# Altium schematic sheet [03]-CONNECTOR,SBC.SchDoc: S32K1_CONTROLLER (part 3 of 3)
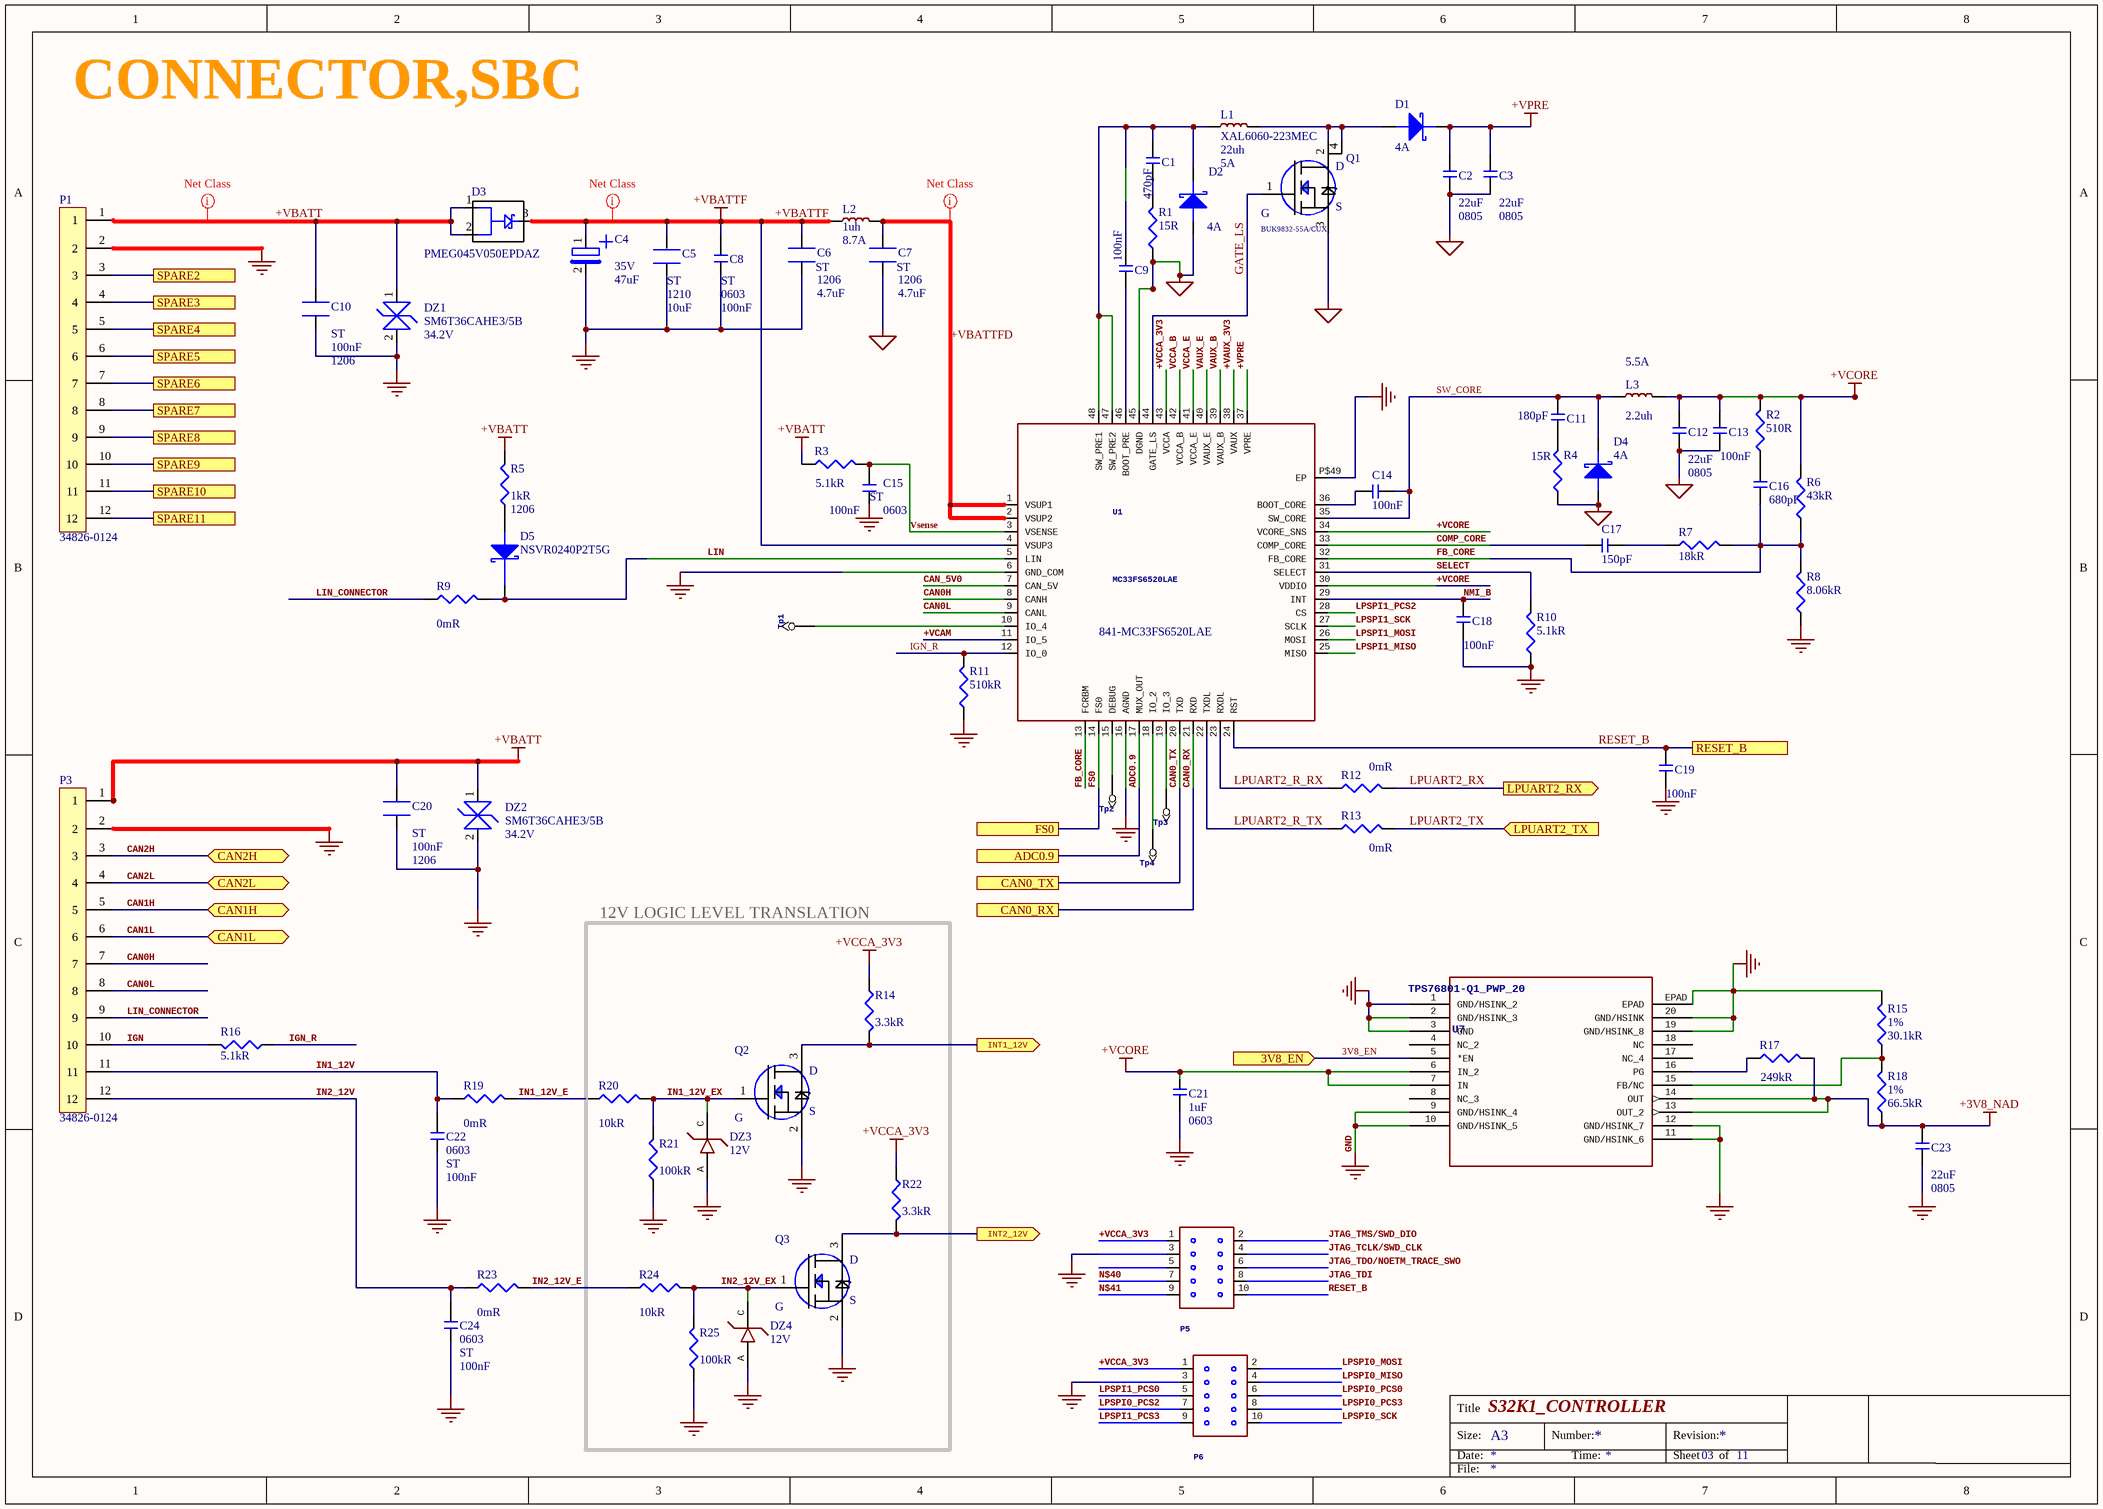
[diagram p2: [03]-CONNECTOR,SBC.SchDoc]

## Library data of the parts (continued)
R5 = ERJ-8GEYJ102V: Res Thick Film 1206 1K Ohm 5% 1/4W ±200ppm/°C Molded SMD Punched Carrier T/R; Manufacturer: Panasonic; Power Rating: 250mW; Voltage Rating: 200V; Supplier 1: Arrow; Manufacturer Part Number: ERJ-8GEYJ102V; Stock 1: 75000; Pricing 1: 5000 = 0.00490, 1 = 0.09480, 10 = 0.02000, 25 = 0.01800, 100 = 0.00860, 250 = 0.00770, 500 = 0.00690, 1000 = 0.00670, 3000 = 0.00600, 6000 = 0.00570, 15000 = 0.00550, 30000 = 0.00530 (USD); Mount: Surface Mount; Case Code (Metric): 3216; Case Code (Imperial): 1206; Contact Plating: Tin; Min Operating Temperature: -55°C; Max Operating Temperature: 155°C; Tolerance: 5%; Packaging: Tape and Reel; Package Quantity: 1; Composition: Thick Film; Number of Terminations: 2; Termination: SMD/SMT; Temperature Coefficient: 200ppm/°C; Military Standard: Not; Max Power Dissipation: 250mW; Voltage Rating (DC): 200V; Features: Automotive AEC-Q200; Length: 3.2mm; Height: 0.6mm; Width: 0.063inch; Depth: 1.6mm; Radiation Hardening: No; REACH SVHC: Unknown; Lead Free: Lead Free; ComponentLink1URL: http://www.mouser.com/ds/2/315/AOA0000CE1-37422.pdf?src-supplier=Mouser; ComponentLink1Description: http://www.mouser.com/ds/2/315/AOA0000CE1-37422.pdf?src-supplier=Mouser; ComponentLink2URL: http://www.farnell.com/datasheets/2059623.pdf?src-supplier=Farnell; ComponentLink2Description: http://www.farnell.com/datasheets/2059623.pdf?src-supplier=Farnell; ComponentLink3URL: http://industrial.panasonic.com/www-data/pdf/AOA0000/AOA0000CE1.pdf?src-supplier=Avnet+Europe; ComponentLink3Description: http://industrial.panasonic.com/www-data/pdf/AOA0000/AOA0000CE1.pdf?src-supplier=Avnet+Europe; ComponentLink4URL: http://www.farnell.com/datasheets/1500035.pdf?src-supplier=Element14; ComponentLink4Description: http://www.farnell.com/datasheets/1500035.pdf?src-supplier=Element14; ComponentLink5URL: http://www.farnell.com/datasheets/1678796.pdf?src-supplier=Element14; ComponentLink5Description: http://www.farnell.com/datasheets/1678796.pdf?src-supplier=Element14; ComponentLink6URL: http://industrial.panasonic.com/www-data/pdf/AOA0000/AOA0000CE1.pdf?src-supplier=Avnet; ComponentLink6Description: http://industrial.panasonic.com/www-data/pdf/AOA0000/AOA0000CE1.pdf?src-supplier=Avnet; ComponentLink7URL: http://datasheet.octopart.com/ERJ-8GEYJ102V-Panasonic-datasheet-13266872.pdf?src-supplier=Allied+Electronics; ComponentLink7Description: http://datasheet.octopart.com/ERJ-8GEYJ102V-Panasonic-datasheet-13266872.pdf?src-supplier=Allied+Electronics; ComponentLink8URL: http://datasheet.octopart.com/ERJ-8GEYJ102V-Panasonic-datasheet-5314550.pdf?src-supplier=Jameco; ComponentLink8Description: http://datasheet.octopart.com/ERJ-8GEYJ102V-Panasonic-datasheet-5314550.pdf?src-supplier=Jameco; ComponentLink9URL: http://datasheet.octopart.com/ERJ-8GEYJ102V-Panasonic-datasheet-61114972.pdf?src-supplier=Newark; ComponentLink9Description: http://datasheet.octopart.com/ERJ-8GEYJ102V-Panasonic-datasheet-61114972.pdf?src-supplier=Newark; ComponentLink10URL: http://datasheet.octopart.com/ERJ-8GEYJ102V-Panasonic-datasheet-10554283.pdf?src-supplier=Newark; ComponentLink10Description: http://datasheet.octopart.com/ERJ-8GEYJ102V-Panasonic-datasheet-10554283.pdf?src-supplier=Newark; ComponentLink11URL: http://datasheet.octopart.com/ERJ-8GEYJ102V-Panasonic-datasheet-37173568.pdf?src-supplier=Electro+Sonic; ComponentLink11Description: http://datasheet.octopart.com/ERJ-8GEYJ102V-Panasonic-datasheet-37173568.pdf?src-supplier=Electro+Sonic; ComponentLink12URL: http://datasheet.octopart.com/ERJ-8GEYJ102V-Panasonic-datasheet-78375410.pdf; ComponentLink12Description: http://datasheet.octopart.com/ERJ-8GEYJ102V-Panasonic-datasheet-78375410.pdf; ComponentLink13URL: http://datasheet.octopart.com/ERJ-8GEYJ102V-Panasonic-datasheet-118598.pdf?src-supplier=Digi-Key; ComponentLink13Description: http://datasheet.octopart.com/ERJ-8GEYJ102V-Panasonic-datasheet-118598.pdf?src-supplier=Digi-Key; ComponentLink14URL: http://datasheet.octopart.com/ERJ-8GEYJ102V-Panasonic-datasheet-5313456.pdf?src-supplier=Farnell; ComponentLink14Description: http://datasheet.octopart.com/ERJ-8GEYJ102V-Panasonic-datasheet-5313456.pdf?src-supplier=Farnell; ComponentLink15URL: http://datasheet.octopart.com/ERJ-8GEYJ102V-Panasonic-datasheet-11480398.pdf?src-supplier=Arrow; ComponentLink15Description: http://datasheet.octopart.com/ERJ-8GEYJ102V-Panasonic-datasheet-11480398.pdf?src-supplier=Arrow; ComponentLink16URL: http://datasheet.octopart.com/ERJ-8GEYJ102V-Panasonic---ECG-datasheet-15994758.pdf?src-supplier=Farnell; ComponentLink16Description: http://datasheet.octopart.com/ERJ-8GEYJ102V-Panasonic---ECG-datasheet-15994758.pdf?src-supplier=Farnell; ComponentLink17URL: http://datasheet.octopart.com/ERJ8GEYJ102V-Panasonic-datasheet-27908757.pdf?src-supplier=Electro+Sonic; ComponentLink17Description: http://datasheet.octopart.com/ERJ8GEYJ102V-Panasonic-datasheet-27908757.pdf?src-supplier=Electro+Sonic; Supplier Part Number 1: ERJ-8GEYJ102V
R6 = RK73H1ETTP4302F: Res Thick Film 0402 43K Ohm 1% 0.1W(1/10W) ±100ppm/C Pad SMD Automotive T/R; Manufacturer: KOA Speer; Power Rating: 63mW; Voltage Rating: 50V; Temperature Coefficient: 100ppm/°C; Supplier 1: Mouser; Manufacturer Part Number: RK73H1ETTP4302F; Stock 1: 29900; Pricing 1: 1 = 0.11000, 10 = 0.02700, 50 = 0.02700, 100 = 0.00700, 1000 = 0.00500, 10000 = 0.00400 (USD); Case/Package: 0402; Case Code (Imperial): 0402; Case Code (Metric): 1005; Min Operating Temperature: -55°C; Max Operating Temperature: 155°C; Tolerance: 1%; Packaging: Tape and Reel; Package Quantity: 10000; Composition: Thick Film; Termination: SMD/SMT; Military Standard: Not; Length: 1mm; Height: 0.35mm; Width: 0.5mm; Depth: 0.5mm; Lead Free: Lead Free; ComponentLink1URL: http://datasheet.octopart.com/RK73H1ETTP4302F-KOA-Speer-datasheet-11541643.pdf?src-supplier=Arrow; ComponentLink1Description: http://datasheet.octopart.com/RK73H1ETTP4302F-KOA-Speer-datasheet-11541643.pdf?src-supplier=Arrow; ComponentLink2URL: http://datasheet.octopart.com/RK73H1ETTP4302F-KOA-Speer-datasheet-11590619.pdf; ComponentLink2Description: http://datasheet.octopart.com/RK73H1ETTP4302F-KOA-Speer-datasheet-11590619.pdf; Supplier Part Number 1: 660-RK73H1ETTP4302F
R7 = RK73B1ETTP183J: Res Thick Film 0402 18K Ohm 5% 0.1W(1/10W) ±200ppm/C Pad SMD Automotive T/R; Manufacturer: KOA Speer; Power Rating: 63mW; Voltage Rating: 50V; Temperature Coefficient: 200ppm/°C; Supplier 1: Arrow; Manufacturer Part Number: RK73B1ETTP183J; Stock 1: 27500; Pricing 1: 1 = 0.00090, 1000 = 0.00080 (USD); Mount: Surface Mount; Case/Package: 0402; Case Code (Imperial): 0402; Case Code (Metric): 1005; Min Operating Temperature: -55°C; Max Operating Temperature: 155°C; Tolerance: 5%; Packaging: Tape and Reel; Package Quantity: 10000; Composition: Thick Film; Termination: SMD/SMT; Military Standard: Not; Voltage Rating (DC): 50V; Length: 1mm; Height: 0.35mm; Width: 0.5mm; Depth: 0.5mm; Lead Free: Lead Free; ComponentLink1URL: https://www.verical.com/server-webapp/html/getDatasheet?partID=170795&src-supplier=Verical; ComponentLink1Description: https://www.verical.com/server-webapp/html/getDatasheet?partID=170795&src-supplier=Verical; ComponentLink2URL: http://datasheet.octopart.com/RK73B1ETTP183J-KOA-Speer-datasheet-11541631.pdf; ComponentLink2Description: http://datasheet.octopart.com/RK73B1ETTP183J-KOA-Speer-datasheet-11541631.pdf; ComponentLink3URL: http://datasheet.octopart.com/RK73B1ETTP183J-KOA-Speer-datasheet-109291.pdf?src-supplier=Garrett; ComponentLink3Description: http://datasheet.octopart.com/RK73B1ETTP183J-KOA-Speer-datasheet-109291.pdf?src-supplier=Garrett; ComponentLink4URL: http://datasheet.octopart.com/RK73B1ETTP183J-KOA-Speer-datasheet-5377395.pdf?src-supplier=Garrett; ComponentLink4Description: http://datasheet.octopart.com/RK73B1ETTP183J-KOA-Speer-datasheet-5377395.pdf?src-supplier=Garrett; ComponentLink5URL: http://datasheet.octopart.com/RK73B1ETTP183J-KOA-Speer-datasheet-5377795.pdf?src-supplier=Garrett; ComponentLink5Description: http://datasheet.octopart.com/RK73B1ETTP183J-KOA-Speer-datasheet-5377795.pdf?src-supplier=Garrett; ComponentLink6URL: http://datasheet.octopart.com/RK73B1ETTP183J-KOA-Speer-datasheet-11616998.pdf?src-supplier=Garrett; ComponentLink6Description: http://datasheet.octopart.com/RK73B1ETTP183J-KOA-Speer-datasheet-11616998.pdf?src-supplier=Garrett
R8 = RK73H1ETTP8061F: Res Thick Film 0402 8.06K Ohm 1% 0.1W(1/10W) ±100ppm/C Pad SMD Automotive T/R; Manufacturer: KOA Speer; Power Rating: 63mW; Voltage Rating: 50V; Temperature Coefficient: 100ppm/°C; Supplier 1: Mouser; Manufacturer Part Number: RK73H1ETTP8061F; Stock 1: 116906; Pricing 1: 1 = 0.11000, 10 = 0.02700, 50 = 0.02700, 100 = 0.00700, 1000 = 0.00500, 10000 = 0.00400 (USD); Mount: Surface Mount; Case/Package: 0402; Case Code (Imperial): 0402; Case Code (Metric): 1005; Min Operating Temperature: -55°C; Max Operating Temperature: 155°C; Tolerance: 1%; Packaging: Tape and Reel; Package Quantity: 10000; Composition: Thick Film; Termination: SMD/SMT; Military Standard: Not; Voltage Rating (DC): 50V; Length: 1mm; Height: 0.35mm; Width: 0.5mm; Depth: 0.5mm; Lead Free: Lead Free; ComponentLink1URL: http://www.koaspeer.com/catimages/Products/RK73H/RK73H.pdf?src-supplier=Mouser; ComponentLink1Description: http://www.koaspeer.com/catimages/Products/RK73H/RK73H.pdf?src-supplier=Mouser; ComponentLink2URL: http://datasheet.octopart.com/RK73H1ETTP8061F-KOA-Speer-datasheet-109211.pdf?src-supplier=Garrett; ComponentLink2Description: http://datasheet.octopart.com/RK73H1ETTP8061F-KOA-Speer-datasheet-109211.pdf?src-supplier=Garrett; ComponentLink3URL: http://datasheet.octopart.com/RK73H1ETTP8061F-KOA-Speer-datasheet-148194.pdf?src-supplier=Garrett; ComponentLink3Description: http://datasheet.octopart.com/RK73H1ETTP8061F-KOA-Speer-datasheet-148194.pdf?src-supplier=Garrett; ComponentLink4URL: http://datasheet.octopart.com/RK73H1ETTP8061F-KOA-Speer-datasheet-5377299.pdf?src-supplier=Garrett; ComponentLink4Description: http://datasheet.octopart.com/RK73H1ETTP8061F-KOA-Speer-datasheet-5377299.pdf?src-supplier=Garrett; ComponentLink5URL: http://datasheet.octopart.com/RK73H1ETTP8061F-KOA-Speer-datasheet-11541643.pdf?src-supplier=Arrow; ComponentLink5Description: http://datasheet.octopart.com/RK73H1ETTP8061F-KOA-Speer-datasheet-11541643.pdf?src-supplier=Arrow; ComponentLink6URL: http://datasheet.octopart.com/RK73H1ETTP8061F-KOA-Speer-datasheet-11590619.pdf; ComponentLink6Description: http://datasheet.octopart.com/RK73H1ETTP8061F-KOA-Speer-datasheet-11590619.pdf
R9 R12 R13 R19 R23 = ERJ-2GE0R00X: ERJ Series 0402 0 Ohm 0.1 W Jumper Surface Mount Thick Film Chip Resistor; Manufacturer: Panasonic; Power Rating: 100mW; Voltage Rating: 50V; Tolerance: 5%; Temperature Coefficient: 600ppm/°C; Supplier 1: Digi-Key; Manufacturer Part Number: ERJ-2GE0R00X; Stock 1: 56751052; Pricing 1: 1 = 0.10000, 10 = 0.03000, 25 = 0.02160, 50 = 0.01640, 100 = 0.01210, 250 = 0.00924, 500 = 0.00740, 1000 = 0.00545, 5000 = 0.00391 (USD); Mount: Surface Mount; Case/Package: 0402; Case Code (Metric): 1005; Case Code (Imperial): 0402; Contact Plating: Tin; Min Operating Temperature: -55°C; Max Operating Temperature: 155°C; Packaging: Tape and Reel; Package Quantity: 1; Composition: Thick Film; Number of Terminations: 2; Termination: SMD/SMT; Military Standard: Not; Max Power Dissipation: 100mW; Voltage Rating (DC): 50V; Features: Automotive AEC-Q200; Length: 1mm; Height: 0.35mm; Width: 0.02inch; Depth: 0.5mm; Radiation Hardening: No; REACH SVHC: No SVHC; Lead Free: Lead Free; ComponentLink1URL: http://industrial.panasonic.com/www-data/pdf/AOA0000/AOA0000CE1.pdf?src-supplier=Avnet; ComponentLink1Description: http://industrial.panasonic.com/www-data/pdf/AOA0000/AOA0000CE1.pdf?src-supplier=Avnet; ComponentLink2URL: http://www.alliedelec.com/m/d/51cd0790071e1666bdb9d00c57fcf960.pdf?src-supplier=Allied+Electronics; ComponentLink2Description: http://www.alliedelec.com/m/d/51cd0790071e1666bdb9d00c57fcf960.pdf?src-supplier=Allied+Electronics; ComponentLink3URL: http://industrial.panasonic.com/www-data/pdf/AOA0000/AOA0000CE1.pdf?src-supplier=Avnet+Europe; ComponentLink3Description: http://industrial.panasonic.com/www-data/pdf/AOA0000/AOA0000CE1.pdf?src-supplier=Avnet+Europe; ComponentLink4URL: http://www.farnell.com/datasheets/2059623.pdf?src-supplier=Farnell; ComponentLink4Description: http://www.farnell.com/datasheets/2059623.pdf?src-supplier=Farnell; ComponentLink5URL: http://www.farnell.com/datasheets/1678796.pdf?src-supplier=Element14; ComponentLink5Description: http://www.farnell.com/datasheets/1678796.pdf?src-supplier=Element14; ComponentLink6URL: http://www.farnell.com/datasheets/2059623.pdf?src-supplier=Element14; ComponentLink6Description: http://www.farnell.com/datasheets/2059623.pdf?src-supplier=Element14; ComponentLink7URL: http://datasheet.octopart.com/ERJ-2GE0R00X-Panasonic-datasheet-13266872.pdf?src-supplier=Newark; ComponentLink7Description: http://datasheet.octopart.com/ERJ-2GE0R00X-Panasonic-datasheet-13266872.pdf?src-supplier=Newark; ComponentLink8URL: http://datasheet.octopart.com/ERJ-2GE0R00X-Panasonic-datasheet-61114972.pdf?src-supplier=Newark; ComponentLink8Description: http://datasheet.octopart.com/ERJ-2GE0R00X-Panasonic-datasheet-61114972.pdf?src-supplier=Newark; ComponentLink9URL: http://datasheet.octopart.com/ERJ-2GE0R00X-Panasonic-datasheet-5314550.pdf?src-supplier=Future+Electronics; ComponentLink9Description: http://datasheet.octopart.com/ERJ-2GE0R00X-Panasonic-datasheet-5314550.pdf?src-supplier=Future+Electronics; ComponentLink10URL: http://datasheet.octopart.com/ERJ-2GE0R00X-Panasonic-datasheet-37173568.pdf?src-supplier=Electro+Sonic; ComponentLink10Description: http://datasheet.octopart.com/ERJ-2GE0R00X-Panasonic-datasheet-37173568.pdf?src-supplier=Electro+Sonic; ComponentLink11URL: http://datasheet.octopart.com/ERJ-2GE0R00X-Panasonic-datasheet-118655.pdf?src-supplier=Digi-Key; ComponentLink11Description: http://datasheet.octopart.com/ERJ-2GE0R00X-Panasonic-datasheet-118655.pdf?src-supplier=Digi-Key; ComponentLink12URL: http://datasheet.octopart.com/ERJ-2GE0R00X-Panasonic-datasheet-5313456.pdf?src-supplier=Farnell; ComponentLink12Description: http://datasheet.octopart.com/ERJ-2GE0R00X-Panasonic-datasheet-5313456.pdf?src-supplier=Farnell; ComponentLink13URL: http://datasheet.octopart.com/ERJ-2GE0R00X-Panasonic-datasheet-10554283.pdf?src-supplier=Farnell; ComponentLink13Description: http://datasheet.octopart.com/ERJ-2GE0R00X-Panasonic-datasheet-10554283.pdf?src-supplier=Farnell; ComponentLink14URL: http://datasheet.octopart.com/ERJ-2GE0R00X-Panasonic-datasheet-11480398.pdf?src-supplier=Arrow; ComponentLink14Description: http://datasheet.octopart.com/ERJ-2GE0R00X-Panasonic-datasheet-11480398.pdf?src-supplier=Arrow; ComponentLink15URL: http://datasheet.octopart.com/ERJ2GE0R00X-Panasonic-datasheet-27908757.pdf?src-supplier=Electro+Sonic; ComponentLink15Description: http://datasheet.octopart.com/ERJ2GE0R00X-Panasonic-datasheet-27908757.pdf?src-supplier=Electro+Sonic; Supplier Part Number 1: P0.0JCT-ND
R10 R16 = RK73B1ETTP512J: Res Thick Film 0402 5.1K Ohm 5% 0.1W(1/10W) ±200ppm/C Pad SMD Automotive T/R; Manufacturer: KOA Speer; Power Rating: 63mW; Voltage Rating: 50V; Temperature Coefficient: 200ppm/°C; Supplier 1: Arrow; Manufacturer Part Number: RK73B1ETTP512J; Stock 1: 150000; Pricing 1: 10000 = 0.00280, 1 = 0.00090, 3000 = 0.00080 (USD); Mount: Surface Mount; Case/Package: 0402; Case Code (Imperial): 0402; Case Code (Metric): 1005; Min Operating Temperature: -55°C; Max Operating Temperature: 155°C; Package Quantity: 10000; Tolerance: 5%; Packaging: Tape and Reel; Composition: Thick Film; Termination: SMD/SMT; Military Standard: Not; Voltage Rating (DC): 50V; Length: 1mm; Height: 0.35mm; Width: 0.5mm; Depth: 0.5mm; Lead Free: Lead Free; ComponentLink1URL: http://www.mouser.com/ds/2/219/RK73B-919.pdf?src-supplier=Mouser; ComponentLink1Description: http://www.mouser.com/ds/2/219/RK73B-919.pdf?src-supplier=Mouser; ComponentLink2URL: https://www.verical.com/server-webapp/html/getDatasheet?partID=162794&src-supplier=Verical; ComponentLink2Description: https://www.verical.com/server-webapp/html/getDatasheet?partID=162794&src-supplier=Verical; ComponentLink3URL: http://datasheet.octopart.com/RK73B1ETTP512J-KOA-Speer-datasheet-109291.pdf?src-supplier=Garrett; ComponentLink3Description: http://datasheet.octopart.com/RK73B1ETTP512J-KOA-Speer-datasheet-109291.pdf?src-supplier=Garrett; ComponentLink4URL: http://datasheet.octopart.com/RK73B1ETTP512J-KOA-Speer-datasheet-5377395.pdf?src-supplier=Garrett; ComponentLink4Description: http://datasheet.octopart.com/RK73B1ETTP512J-KOA-Speer-datasheet-5377395.pdf?src-supplier=Garrett; ComponentLink5URL: http://datasheet.octopart.com/RK73B1ETTP512J-KOA-Speer-datasheet-5377795.pdf?src-supplier=Garrett; ComponentLink5Description: http://datasheet.octopart.com/RK73B1ETTP512J-KOA-Speer-datasheet-5377795.pdf?src-supplier=Garrett; ComponentLink6URL: http://datasheet.octopart.com/RK73B1ETTP512J-KOA-Speer-datasheet-11616998.pdf?src-supplier=Garrett; ComponentLink6Description: http://datasheet.octopart.com/RK73B1ETTP512J-KOA-Speer-datasheet-11616998.pdf?src-supplier=Garrett; ComponentLink7URL: http://datasheet.octopart.com/RK73B1ETTP512J-KOA-Speer-datasheet-11541631.pdf; ComponentLink7Description: http://datasheet.octopart.com/RK73B1ETTP512J-KOA-Speer-datasheet-11541631.pdf
R11 = RK73B1ETTP514J: Res Thick Film 0402 510K Ohm 5% 0.1W(1/10W) ±200ppm/C Pad SMD Automotive T/R; Manufacturer: KOA Speer; Power Rating: 63mW; Voltage Rating: 50V; Temperature Coefficient: 200ppm/°C; Supplier 1: Arrow; Manufacturer Part Number: RK73B1ETTP514J; Stock 1: 10000; Pricing 1: 1 = 0.00350, 25 = 0.00340, 250 = 0.00330, 1000 = 0.00320, 6000 = 0.00310 (USD); Mount: Surface Mount; Case/Package: 0402; Case Code (Imperial): 0402; Case Code (Metric): 1005; Min Operating Temperature: -55°C; Max Operating Temperature: 155°C; Tolerance: 5%; Packaging: Tape and Reel; Package Quantity: 10000; Composition: Thick Film; Termination: SMD/SMT; Military Standard: Not; Voltage Rating (DC): 50V; Length: 1mm; Height: 0.35mm; Width: 0.5mm; Depth: 0.5mm; Lead Free: Lead Free; ComponentLink1URL: http://www.mouser.com/ds/2/219/RK73B-919.pdf?src-supplier=Mouser; ComponentLink1Description: http://www.mouser.com/ds/2/219/RK73B-919.pdf?src-supplier=Mouser; ComponentLink2URL: http://datasheet.octopart.com/RK73B1ETTP514J-KOA-Speer-datasheet-109291.pdf?src-supplier=Garrett; ComponentLink2Description: http://datasheet.octopart.com/RK73B1ETTP514J-KOA-Speer-datasheet-109291.pdf?src-supplier=Garrett; ComponentLink3URL: http://datasheet.octopart.com/RK73B1ETTP514J-KOA-Speer-datasheet-5377795.pdf?src-supplier=Garrett; ComponentLink3Description: http://datasheet.octopart.com/RK73B1ETTP514J-KOA-Speer-datasheet-5377795.pdf?src-supplier=Garrett; ComponentLink4URL: http://datasheet.octopart.com/RK73B1ETTP514J-KOA-Speer-datasheet-5377395.pdf?src-supplier=Garrett; ComponentLink4Description: http://datasheet.octopart.com/RK73B1ETTP514J-KOA-Speer-datasheet-5377395.pdf?src-supplier=Garrett; ComponentLink5URL: http://datasheet.octopart.com/RK73B1ETTP514J-KOA-Speer-datasheet-11616998.pdf?src-supplier=Garrett; ComponentLink5Description: http://datasheet.octopart.com/RK73B1ETTP514J-KOA-Speer-datasheet-11616998.pdf?src-supplier=Garrett; ComponentLink6URL: http://datasheet.octopart.com/RK73B1ETTP514J-KOA-Speer-datasheet-11541631.pdf; ComponentLink6Description: http://datasheet.octopart.com/RK73B1ETTP514J-KOA-Speer-datasheet-11541631.pdf; Supplier Part Number 1: RK73B1ETTP514J
R14 R22 = ERJ-2GEJ332X: Res Thick Film 0402 3.3K Ohm 5% 1/10W ±200ppm/°C Molded SMD SMD Punched Carrier T/R; Manufacturer: Panasonic; Power Rating: 100mW; Voltage Rating: 50V; Supplier 1: Digi-Key; Manufacturer Part Number: ERJ-2GEJ332X; Stock 1: 1482370; Pricing 1: 1 = 0.10000, 10 = 0.03100, 100 = 0.01250, 1000 = 0.00560, 2500 = 0.00486, 5000 = 0.00401 (USD); Mount: Surface Mount; Case/Package: 0402; Case Code (Metric): 1005; Case Code (Imperial): 0402; Contact Plating: Tin; Min Operating Temperature: -55°C; Max Operating Temperature: 155°C; Tolerance: 5%; Packaging: Tape and Reel; Package Quantity: 1; Composition: Thick Film; Number of Terminations: 2; Military Standard: Not; Temperature Coefficient: 200ppm/°C; Termination: SMD/SMT; Max Power Dissipation: 100mW; Voltage Rating (DC): 50V; Features: Automotive AEC-Q200; Length: 1mm; Height: 0.35mm; Width: 0.02inch; Depth: 0.5mm; Radiation Hardening: No; REACH SVHC: No SVHC; Lead Free: Lead Free; ComponentLink1URL: http://www.farnell.com/datasheets/2059623.pdf?src-supplier=Farnell; ComponentLink1Description: http://www.farnell.com/datasheets/2059623.pdf?src-supplier=Farnell; ComponentLink2URL: https://www.alliedelec.com/m/d/51cd0790071e1666bdb9d00c57fcf960.pdf?src-supplier=Allied+Electronics; ComponentLink2Description: https://www.alliedelec.com/m/d/51cd0790071e1666bdb9d00c57fcf960.pdf?src-supplier=Allied+Electronics; ComponentLink3URL: http://www.mouser.com/ds/2/315/AOA0000C84-947596.pdf?src-supplier=Mouser; ComponentLink3Description: http://www.mouser.com/ds/2/315/AOA0000C84-947596.pdf?src-supplier=Mouser; ComponentLink4URL: http://www.farnell.com/datasheets/1678796.pdf?src-supplier=Element14; ComponentLink4Description: http://www.farnell.com/datasheets/1678796.pdf?src-supplier=Element14; ComponentLink5URL: http://industrial.panasonic.com/www-data/pdf/AOA0000/AOA0000CE1.pdf?src-supplier=Avnet+Asia; ComponentLink5Description: http://industrial.panasonic.com/www-data/pdf/AOA0000/AOA0000CE1.pdf?src-supplier=Avnet+Asia; ComponentLink6URL: http://www.jameco.com/Jameco/Products/ProdDS/1986932.pdf?src-supplier=Jameco; ComponentLink6Description: http://www.jameco.com/Jameco/Products/ProdDS/1986932.pdf?src-supplier=Jameco; ComponentLink7URL: http://industrial.panasonic.com/www-data/pdf/AOA0000/AOA0000CE1.pdf?src-supplier=Avnet+Europe; ComponentLink7Description: http://industrial.panasonic.com/www-data/pdf/AOA0000/AOA0000CE1.pdf?src-supplier=Avnet+Europe; ComponentLink8URL: http://www.farnell.com/datasheets/1500035.pdf?src-supplier=Element14; ComponentLink8Description: http://www.farnell.com/datasheets/1500035.pdf?src-supplier=Element14; ComponentLink9URL: http://industrial.panasonic.com/www-data/pdf/AOA0000/AOA0000CE1.pdf?src-supplier=Avnet; ComponentLink9Description: http://industrial.panasonic.com/www-data/pdf/AOA0000/AOA0000CE1.pdf?src-supplier=Avnet; ComponentLink10URL: http://industrial.panasonic.com/www-data/pdf/AOA0000/AOA0000CE1.pdf?src-supplier=Future+Electronics; ComponentLink10Description: http://industrial.panasonic.com/www-data/pdf/AOA0000/AOA0000CE1.pdf?src-supplier=Future+Electronics; ComponentLink11URL: http://datasheet.octopart.com/ERJ-2GEJ332X-Panasonic-datasheet-13266872.pdf?src-supplier=Newark; ComponentLink11Description: http://datasheet.octopart.com/ERJ-2GEJ332X-Panasonic-datasheet-13266872.pdf?src-supplier=Newark; ComponentLink12URL: http://datasheet.octopart.com/ERJ-2GEJ332X-Panasonic-datasheet-5314550.pdf?src-supplier=Future+Electronics; ComponentLink12Description: http://datasheet.octopart.com/ERJ-2GEJ332X-Panasonic-datasheet-5314550.pdf?src-supplier=Future+Electronics; ComponentLink13URL: http://datasheet.octopart.com/ERJ-2GEJ332X-Panasonic-datasheet-61114972.pdf?src-supplier=Newark; ComponentLink13Description: http://datasheet.octopart.com/ERJ-2GEJ332X-Panasonic-datasheet-61114972.pdf?src-supplier=Newark; ComponentLink14URL: http://datasheet.octopart.com/ERJ-2GEJ332X-Panasonic-datasheet-37173568.pdf?src-supplier=Electro+Sonic; ComponentLink14Description: http://datasheet.octopart.com/ERJ-2GEJ332X-Panasonic-datasheet-37173568.pdf?src-supplier=Electro+Sonic; ComponentLink15URL: http://datasheet.octopart.com/ERJ-2GEJ332X-Panasonic-datasheet-78375410.pdf; ComponentLink15Description: http://datasheet.octopart.com/ERJ-2GEJ332X-Panasonic-datasheet-78375410.pdf; ComponentLink16URL: http://datasheet.octopart.com/ERJ-2GEJ332X-Panasonic-datasheet-118598.pdf?src-supplier=Digi-Key; ComponentLink16Description: http://datasheet.octopart.com/ERJ-2GEJ332X-Panasonic-datasheet-118598.pdf?src-supplier=Digi-Key; ComponentLink17URL: http://datasheet.octopart.com/ERJ-2GEJ332X-Panasonic-datasheet-5313456.pdf?src-supplier=Farnell; ComponentLink17Description: http://datasheet.octopart.com/ERJ-2GEJ332X-Panasonic-datasheet-5313456.pdf?src-supplier=Farnell; ComponentLink18URL: http://datasheet.octopart.com/ERJ-2GEJ332X-Panasonic-datasheet-10554283.pdf?src-supplier=Farnell; ComponentLink18Description: http://datasheet.octopart.com/ERJ-2GEJ332X-Panasonic-datasheet-10554283.pdf?src-supplier=Farnell; ComponentLink19URL: http://datasheet.octopart.com/ERJ-2GEJ332X-Panasonic-datasheet-11480398.pdf?src-supplier=Arrow; ComponentLink19Description: http://datasheet.octopart.com/ERJ-2GEJ332X-Panasonic-datasheet-11480398.pdf?src-supplier=Arrow; ComponentLink20URL: http://datasheet.octopart.com/ERJ-2GEJ332X-Panasonic---ECG-datasheet-15994758.pdf?src-supplier=Farnell; ComponentLink20Description: http://datasheet.octopart.com/ERJ-2GEJ332X-Panasonic---ECG-datasheet-15994758.pdf?src-supplier=Farnell; ComponentLink21URL: http://datasheet.octopart.com/ERJ2GEJ332X-Panasonic-datasheet-27908757.pdf?src-supplier=Electro+Sonic; ComponentLink21Description: http://datasheet.octopart.com/ERJ2GEJ332X-Panasonic-datasheet-27908757.pdf?src-supplier=Electro+Sonic; Supplier Part Number 1: P3.3KJCT-ND
R15 = RK73H1ETTP3012F: Res Thick Film 0402 30.1K Ohm 1% 0.1W(1/10W) ±100ppm/C Pad SMD Automotive T/R; Manufacturer: KOA Speer; Power Rating: 63mW; Voltage Rating: 50V; Temperature Coefficient: 100ppm/°C; Supplier 1: Arrow; Manufacturer Part Number: RK73H1ETTP3012F; Stock 1: 240000; Pricing 1: 10000 = 0.00380, 1 = 0.00150, 10 = 0.00140, 1000 = 0.00130 (USD); Mount: Surface Mount; Case/Package: 0402; Case Code (Imperial): 0402; Case Code (Metric): 1005; Min Operating Temperature: -55°C; Max Operating Temperature: 155°C; Packaging: Tape and Reel; Package Quantity: 10000; Composition: Thick Film; Termination: SMD/SMT; Military Standard: Not; Voltage Rating (DC): 50V; Length: 1mm; Height: 0.35mm; Width: 0.5mm; Depth: 0.5mm; Lead Free: Lead Free; ComponentLink1URL: http://datasheet.octopart.com/RK73H1ETTP3012F-KOA-Speer-datasheet-109211.pdf?src-supplier=Garrett; ComponentLink1Description: http://datasheet.octopart.com/RK73H1ETTP3012F-KOA-Speer-datasheet-109211.pdf?src-supplier=Garrett; ComponentLink2URL: http://datasheet.octopart.com/RK73H1ETTP3012F-KOA-Speer-datasheet-148194.pdf?src-supplier=Garrett; ComponentLink2Description: http://datasheet.octopart.com/RK73H1ETTP3012F-KOA-Speer-datasheet-148194.pdf?src-supplier=Garrett; ComponentLink3URL: http://datasheet.octopart.com/RK73H1ETTP3012F-KOA-Speer-datasheet-5377299.pdf?src-supplier=Garrett; ComponentLink3Description: http://datasheet.octopart.com/RK73H1ETTP3012F-KOA-Speer-datasheet-5377299.pdf?src-supplier=Garrett; ComponentLink4URL: http://datasheet.octopart.com/RK73H1ETTP3012F-KOA-Speer-datasheet-11590619.pdf; ComponentLink4Description: http://datasheet.octopart.com/RK73H1ETTP3012F-KOA-Speer-datasheet-11590619.pdf; ComponentLink5URL: http://datasheet.octopart.com/RK73H-%7C-Flat-Chip-Resistors-%28Precision-Grade%29-KOA-Speer-datasheet-family-85.pdf; ComponentLink5Description: http://datasheet.octopart.com/RK73H-%7C-Flat-Chip-Resistors-%28Precision-Grade%29-KOA-Speer-datasheet-family-85.pdf; Supplier Part Number 1: RK73H1ETTP3012F
R17 = RK73H1ETTP2493F: Res Thick Film 0402 249K Ohm 1% 0.1W(1/10W) ±100ppm/C Pad SMD Automotive T/R; Manufacturer: KOA Speer; Power Rating: 63mW; Voltage Rating: 50V; Temperature Coefficient: 100ppm/°C; Supplier 1: Mouser; Manufacturer Part Number: RK73H1ETTP2493F; Stock 1: 109501; Pricing 1: 1 = 0.11000, 10 = 0.02700, 50 = 0.02700, 100 = 0.00700, 1000 = 0.00500, 10000 = 0.00400 (USD); Case/Package: 0402; Case Code (Imperial): 0402; Case Code (Metric): 1005; Min Operating Temperature: -55°C; Max Operating Temperature: 155°C; Packaging: Tape and Reel; Package Quantity: 10000; Tolerance: 1%; Composition: Thick Film; Termination: SMD/SMT; Military Standard: Not; Voltage Rating (DC): 50V; Length: 1mm; Height: 0.35mm; Width: 0.5mm; Depth: 0.5mm; Lead Free: Lead Free; ComponentLink1URL: http://datasheet.octopart.com/RK73H1ETTP2493F-KOA-Speer-datasheet-109211.pdf?src-supplier=Garrett; ComponentLink1Description: http://datasheet.octopart.com/RK73H1ETTP2493F-KOA-Speer-datasheet-109211.pdf?src-supplier=Garrett; ComponentLink2URL: http://datasheet.octopart.com/RK73H1ETTP2493F-KOA-Speer-datasheet-148194.pdf?src-supplier=Garrett; ComponentLink2Description: http://datasheet.octopart.com/RK73H1ETTP2493F-KOA-Speer-datasheet-148194.pdf?src-supplier=Garrett; ComponentLink3URL: http://datasheet.octopart.com/RK73H1ETTP2493F-KOA-Speer-datasheet-5377299.pdf?src-supplier=Garrett; ComponentLink3Description: http://datasheet.octopart.com/RK73H1ETTP2493F-KOA-Speer-datasheet-5377299.pdf?src-supplier=Garrett; ComponentLink4URL: http://datasheet.octopart.com/RK73H1ETTP2493F-KOA-Speer-datasheet-11590619.pdf; ComponentLink4Description: http://datasheet.octopart.com/RK73H1ETTP2493F-KOA-Speer-datasheet-11590619.pdf
R18 = RK73H1ETTP6652F: Res Thick Film 0402 66.5K Ohm 1% 0.1W(1/10W) ±100ppm/C Pad SMD Automotive T/R; Manufacturer: KOA Speer; Power Rating: 63mW; Voltage Rating: 50V; Temperature Coefficient: 100ppm/°C; Supplier 1: Arrow; Manufacturer Part Number: RK73H1ETTP6652F; Stock 1: 10230; Pricing 1: 1 = 0.10450, 10 = 0.02540, 25 = 0.02520, 100 = 0.00650, 250 = 0.00640, 500 = 0.00570, 1000 = 0.00540, 3000 = 0.00510, 6000 = 0.00470 (USD); Case/Package: 0402; Case Code (Imperial): 0402; Case Code (Metric): 1005; Min Operating Temperature: -55°C; Max Operating Temperature: 155°C; Packaging: Tape and Reel; Package Quantity: 10000; Composition: Thick Film; Termination: SMD/SMT; Working Voltage: 50V; Military Standard: Not; Voltage Rating (DC): 50V; Length: 1mm; Height: 0.35mm; Width: 0.5mm; Depth: 0.5mm; Lead Free: Lead Free; ComponentLink1URL: http://datasheet.octopart.com/RK73H1ETTP6652F-KOA-Speer-datasheet-109211.pdf?src-supplier=Garrett; ComponentLink1Description: http://datasheet.octopart.com/RK73H1ETTP6652F-KOA-Speer-datasheet-109211.pdf?src-supplier=Garrett; ComponentLink2URL: http://datasheet.octopart.com/RK73H1ETTP6652F-KOA-Speer-datasheet-5377299.pdf?src-supplier=Garrett; ComponentLink2Description: http://datasheet.octopart.com/RK73H1ETTP6652F-KOA-Speer-datasheet-5377299.pdf?src-supplier=Garrett; ComponentLink3URL: http://datasheet.octopart.com/RK73H1ETTP6652F-KOA-Speer-datasheet-148194.pdf?src-supplier=Garrett; ComponentLink3Description: http://datasheet.octopart.com/RK73H1ETTP6652F-KOA-Speer-datasheet-148194.pdf?src-supplier=Garrett; ComponentLink4URL: http://datasheet.octopart.com/RK73H1ETTP6652F-KOA-Speer-datasheet-11590619.pdf; ComponentLink4Description: http://datasheet.octopart.com/RK73H1ETTP6652F-KOA-Speer-datasheet-11590619.pdf; Supplier Part Number 1: RK73H1ETTP6652F
R20 R24 = ERJ-2GEJ103X: Res Thick Film 0402 10K Ohm 5% 1/10W ±200ppm/°C Molded SMD SMD Punched Carrier T/R; Manufacturer: Panasonic; Power Rating: 100mW; Voltage Rating: 50V; Supplier 1: Digi-Key; Manufacturer Part Number: ERJ-2GEJ103X; Stock 1: 15334974; Pricing 1: 1 = 0.10000, 10 = 0.03100, 100 = 0.01250, 1000 = 0.00560, 2500 = 0.00486, 5000 = 0.00401 (USD); Mount: Surface Mount; Case/Package: 0402; Case Code (Metric): 1005; Case Code (Imperial): 0402; Contact Plating: Tin; Min Operating Temperature: -55°C; Max Operating Temperature: 155°C; Packaging: Cut Tape; Tolerance: 5%; Package Quantity: 1; Composition: Thick Film; Number of Terminations: 2; Termination: SMD/SMT; Military Standard: Not; Temperature Coefficient: 200ppm/°C; Max Power Dissipation: 100mW; Voltage Rating (DC): 50V; Features: Automotive AEC-Q200; Length: 1mm; Height: 0.35mm; Width: 0.02inch; Depth: 0.5mm; Radiation Hardening: No; REACH SVHC: No SVHC; Lead Free: Lead Free; ComponentLink1URL: http://industrial.panasonic.com/www-data/pdf/AOA0000/AOA0000CE1.pdf?src-supplier=Avnet+Europe; ComponentLink1Description: http://industrial.panasonic.com/www-data/pdf/AOA0000/AOA0000CE1.pdf?src-supplier=Avnet+Europe; ComponentLink2URL: http://www.farnell.com/datasheets/1678796.pdf?src-supplier=Element14; ComponentLink2Description: http://www.farnell.com/datasheets/1678796.pdf?src-supplier=Element14; ComponentLink3URL: http://www.mouser.com/ds/2/315/AOA0000CE1-37422.pdf?src-supplier=Mouser; ComponentLink3Description: http://www.mouser.com/ds/2/315/AOA0000CE1-37422.pdf?src-supplier=Mouser; ComponentLink4URL: http://www.farnell.com/datasheets/2059623.pdf?src-supplier=Farnell; ComponentLink4Description: http://www.farnell.com/datasheets/2059623.pdf?src-supplier=Farnell; ComponentLink5URL: https://www.alliedelec.com/m/d/51cd0790071e1666bdb9d00c57fcf960.pdf?src-supplier=Allied+Electronics; ComponentLink5Description: https://www.alliedelec.com/m/d/51cd0790071e1666bdb9d00c57fcf960.pdf?src-supplier=Allied+Electronics; ComponentLink6URL: http://www.jameco.com/Jameco/Products/ProdDS/1935721.pdf?src-supplier=Jameco; ComponentLink6Description: http://www.jameco.com/Jameco/Products/ProdDS/1935721.pdf?src-supplier=Jameco; ComponentLink7URL: http://industrial.panasonic.com/www-data/pdf/AOA0000/AOA0000CE1.pdf?src-supplier=Avnet; ComponentLink7Description: http://industrial.panasonic.com/www-data/pdf/AOA0000/AOA0000CE1.pdf?src-supplier=Avnet; ComponentLink8URL: http://datasheet.octopart.com/ERJ-2GEJ103X-Panasonic-datasheet-13266872.pdf?src-supplier=Newark; ComponentLink8Description: http://datasheet.octopart.com/ERJ-2GEJ103X-Panasonic-datasheet-13266872.pdf?src-supplier=Newark; ComponentLink9URL: http://datasheet.octopart.com/ERJ-2GEJ103X-Panasonic-datasheet-61114972.pdf?src-supplier=Farnell; ComponentLink9Description: http://datasheet.octopart.com/ERJ-2GEJ103X-Panasonic-datasheet-61114972.pdf?src-supplier=Farnell; ComponentLink10URL: http://datasheet.octopart.com/ERJ-2GEJ103X-Panasonic-datasheet-5314550.pdf?src-supplier=Element14; ComponentLink10Description: http://datasheet.octopart.com/ERJ-2GEJ103X-Panasonic-datasheet-5314550.pdf?src-supplier=Element14; ComponentLink11URL: http://datasheet.octopart.com/ERJ-2GEJ103X-Panasonic-datasheet-78375410.pdf; ComponentLink11Description: http://datasheet.octopart.com/ERJ-2GEJ103X-Panasonic-datasheet-78375410.pdf; ComponentLink12URL: http://datasheet.octopart.com/ERJ-2GEJ103X-Panasonic-datasheet-17720667.pdf?src-supplier=Jameco; ComponentLink12Description: http://datasheet.octopart.com/ERJ-2GEJ103X-Panasonic-datasheet-17720667.pdf?src-supplier=Jameco; ComponentLink13URL: http://datasheet.octopart.com/ERJ-2GEJ103X-Panasonic-datasheet-37173568.pdf?src-supplier=Electro+Sonic; ComponentLink13Description: http://datasheet.octopart.com/ERJ-2GEJ103X-Panasonic-datasheet-37173568.pdf?src-supplier=Electro+Sonic; ComponentLink14URL: http://datasheet.octopart.com/ERJ-2GEJ103X-Panasonic-datasheet-118598.pdf?src-supplier=Digi-Key; ComponentLink14Description: http://datasheet.octopart.com/ERJ-2GEJ103X-Panasonic-datasheet-118598.pdf?src-supplier=Digi-Key; ComponentLink15URL: http://datasheet.octopart.com/ERJ-2GEJ103X-Panasonic-datasheet-5313456.pdf?src-supplier=Farnell; ComponentLink15Description: http://datasheet.octopart.com/ERJ-2GEJ103X-Panasonic-datasheet-5313456.pdf?src-supplier=Farnell; ComponentLink16URL: http://datasheet.octopart.com/ERJ-2GEJ103X-Panasonic-datasheet-10554283.pdf?src-supplier=Farnell; ComponentLink16Description: http://datasheet.octopart.com/ERJ-2GEJ103X-Panasonic-datasheet-10554283.pdf?src-supplier=Farnell; ComponentLink17URL: http://datasheet.octopart.com/ERJ-2GEJ103X-Panasonic-datasheet-11480398.pdf?src-supplier=Arrow; ComponentLink17Description: http://datasheet.octopart.com/ERJ-2GEJ103X-Panasonic-datasheet-11480398.pdf?src-supplier=Arrow; ComponentLink18URL: http://datasheet.octopart.com/ERJ-2GEJ103X-Panasonic---ECG-datasheet-15994758.pdf?src-supplier=Farnell; ComponentLink18Description: http://datasheet.octopart.com/ERJ-2GEJ103X-Panasonic---ECG-datasheet-15994758.pdf?src-supplier=Farnell; ComponentLink19URL: http://datasheet.octopart.com/ERJ2GEJ103X-Panasonic-datasheet-27908757.pdf?src-supplier=Electro+Sonic; ComponentLink19Description: http://datasheet.octopart.com/ERJ2GEJ103X-Panasonic-datasheet-27908757.pdf?src-supplier=Electro+Sonic; ComponentLink20URL: http://datasheet.octopart.com/Thick-Film-Chip-Resistors-Panasonic-datasheet-family-105.pdf; ComponentLink20Description: http://datasheet.octopart.com/Thick-Film-Chip-Resistors-Panasonic-datasheet-family-105.pdf; Supplier Part Number 1: P10KJCT-ND
R21 R25 = ERJ-2GEJ104X: Res Thick Film 0402 100K Ohm 5% 1/10W ±200ppm/°C Molded SMD SMD Punched Carrier T/R; Manufacturer: Panasonic; Power Rating: 100mW; Voltage Rating: 50V; Supplier 1: Arrow; Manufacturer Part Number: ERJ-2GEJ104X; Stock 1: 1680000; Pricing 1: 10000 = 0.00340, 30000 = 0.00280, 100000 = 0.00270, 1 = 0.00280, 100 = 0.00270, 500 = 0.00260, 6000 = 0.00250 (USD); Mount: Surface Mount; Case/Package: 0402; Case Code (Metric): 1005; Contact Plating: Tin; Min Operating Temperature: -55°C; Max Operating Temperature: 155°C; Tolerance: 5%; Packaging: Tape and Reel; Package Quantity: 1; Composition: Thick Film; Number of Terminations: 2; Temperature Coefficient: 200ppm/°C; Military Standard: Not; Termination: SMD/SMT; Max Power Dissipation: 100mW; Voltage Rating (DC): 50V; Features: Automotive AEC-Q200; Length: 1mm; Height: 0.35mm; Width: 0.02inch; Depth: 0.5mm; Radiation Hardening: No; REACH SVHC: No SVHC; Lead Free: Lead Free; ComponentLink1URL: http://www.farnell.com/datasheets/2059623.pdf?src-supplier=Farnell; ComponentLink1Description: http://www.farnell.com/datasheets/2059623.pdf?src-supplier=Farnell; ComponentLink2URL: http://www.jameco.com/Jameco/Products/ProdDS/1986799.pdf?src-supplier=Jameco; ComponentLink2Description: http://www.jameco.com/Jameco/Products/ProdDS/1986799.pdf?src-supplier=Jameco; ComponentLink3URL: http://www.mouser.com/ds/2/315/AOA0000C84-947596.pdf?src-supplier=Mouser; ComponentLink3Description: http://www.mouser.com/ds/2/315/AOA0000C84-947596.pdf?src-supplier=Mouser; ComponentLink4URL: https://www.alliedelec.com/m/d/51cd0790071e1666bdb9d00c57fcf960.pdf?src-supplier=Allied+Electronics; ComponentLink4Description: https://www.alliedelec.com/m/d/51cd0790071e1666bdb9d00c57fcf960.pdf?src-supplier=Allied+Electronics; ComponentLink5URL: http://industrial.panasonic.com/www-data/pdf/AOA0000/AOA0000CE1.pdf?src-supplier=Avnet; ComponentLink5Description: http://industrial.panasonic.com/www-data/pdf/AOA0000/AOA0000CE1.pdf?src-supplier=Avnet; ComponentLink6URL: http://www.farnell.com/datasheets/1500035.pdf?src-supplier=Element14; ComponentLink6Description: http://www.farnell.com/datasheets/1500035.pdf?src-supplier=Element14; ComponentLink7URL: http://datasheet.octopart.com/ERJ-2GEJ104X-Panasonic-datasheet-13266872.pdf?src-supplier=Newark; ComponentLink7Description: http://datasheet.octopart.com/ERJ-2GEJ104X-Panasonic-datasheet-13266872.pdf?src-supplier=Newark; ComponentLink8URL: http://datasheet.octopart.com/ERJ-2GEJ104X-Panasonic-datasheet-5314550.pdf?src-supplier=Jameco; ComponentLink8Description: http://datasheet.octopart.com/ERJ-2GEJ104X-Panasonic-datasheet-5314550.pdf?src-supplier=Jameco; ComponentLink9URL: http://datasheet.octopart.com/ERJ-2GEJ104X-Panasonic-datasheet-61114972.pdf?src-supplier=Newark; ComponentLink9Description: http://datasheet.octopart.com/ERJ-2GEJ104X-Panasonic-datasheet-61114972.pdf?src-supplier=Newark; ComponentLink10URL: http://datasheet.octopart.com/ERJ-2GEJ104X-Panasonic-datasheet-10554283.pdf?src-supplier=Newark; ComponentLink10Description: http://datasheet.octopart.com/ERJ-2GEJ104X-Panasonic-datasheet-10554283.pdf?src-supplier=Newark; ComponentLink11URL: http://datasheet.octopart.com/ERJ-2GEJ104X-Panasonic-datasheet-37173568.pdf?src-supplier=Electro+Sonic; ComponentLink11Description: http://datasheet.octopart.com/ERJ-2GEJ104X-Panasonic-datasheet-37173568.pdf?src-supplier=Electro+Sonic; ComponentLink12URL: http://datasheet.octopart.com/ERJ-2GEJ104X-Panasonic-datasheet-78375410.pdf; ComponentLink12Description: http://datasheet.octopart.com/ERJ-2GEJ104X-Panasonic-datasheet-78375410.pdf; ComponentLink13URL: http://datasheet.octopart.com/ERJ-2GEJ104X-Panasonic-datasheet-118655.pdf?src-supplier=Digi-Key; ComponentLink13Description: http://datasheet.octopart.com/ERJ-2GEJ104X-Panasonic-datasheet-118655.pdf?src-supplier=Digi-Key; ComponentLink14URL: http://datasheet.octopart.com/ERJ-2GEJ104X-Panasonic-datasheet-5313456.pdf?src-supplier=Farnell; ComponentLink14Description: http://datasheet.octopart.com/ERJ-2GEJ104X-Panasonic-datasheet-5313456.pdf?src-supplier=Farnell; ComponentLink15URL: http://datasheet.octopart.com/ERJ-2GEJ104X-Panasonic-datasheet-11480398.pdf?src-supplier=Arrow; ComponentLink15Description: http://datasheet.octopart.com/ERJ-2GEJ104X-Panasonic-datasheet-11480398.pdf?src-supplier=Arrow; ComponentLink16URL: http://datasheet.octopart.com/ERJ-2GEJ104X-Panasonic---ECG-datasheet-15994758.pdf?src-supplier=Farnell; ComponentLink16Description: http://datasheet.octopart.com/ERJ-2GEJ104X-Panasonic---ECG-datasheet-15994758.pdf?src-supplier=Farnell; ComponentLink17URL: http://datasheet.octopart.com/ERJ2GEJ104X-Panasonic-datasheet-27908757.pdf?src-supplier=Electro+Sonic; ComponentLink17Description: http://datasheet.octopart.com/ERJ2GEJ104X-Panasonic-datasheet-27908757.pdf?src-supplier=Electro+Sonic; ComponentLink18URL: http://datasheet.octopart.com/Thick-Film-Chip-Resistors-Panasonic-datasheet-family-105.pdf; ComponentLink18Description: http://datasheet.octopart.com/Thick-Film-Chip-Resistors-Panasonic-datasheet-family-105.pdf; Supplier Part Number 1: ERJ-2GEJ104X
Tp1-Tp4 = TP: GateName_1: G$1; TP?: >TP_NAME; SymbolName_1: TP; LibraryName: WeOnReferencePlatform; DeviceSetName: TP
U1 = MC33FS6520LAE: Manufacturer: NXP Semiconductors; GateName_1: G$1; SymbolName_1: MC33FS6520LAE; LibraryName: WeOnReferencePlatform; DeviceSetName: MC33FS6520LAE; Supplier 1: Mouser; Manufacturer Part Number: MC33FS6520LAE; Stock 1: 250; Pricing 1: 1 = 7.81000, 10 = 7.06000, 50 = 6.34000, 100 = 5.84000, 1000 = 4.43000, 10000 = 4.43000 (USD)
U7 = TPS76801-Q1_PWP_20: GENERIC_PART_NUMBER: TPS76801Q1; MANUFACTURER: Texas Instruments; MANUFACTURER_PART_NUMBER: tps76801q1_pwp_20; GateName_1: A; FAMILY_NAME: SINGLE CHANNEL LDO; INDUSTRY_STD_PKG_TYPE: HTSSOP; PACKAGE_DESIGNATOR: PWP; PIN_COUNT: 20; SymbolName_1: TPS76801-Q1_PWP_20; LibraryName: WeOnReferencePlatform; DeviceSetName: TPS76801-Q1_PWP_20; DATASHEETURL: httpwww.ti.comlitgpnTPS76801Q1; VENDOR: Texas Instruments